# Altium schematic sheet Power-Supply-Card.SchDoc
size A2 portrait; Organization: Altium Limited; Address1: L3, 12a Rodborough Rd; Address2: Frenchs Forest; Address3: NSW; Address4: Australia 2086
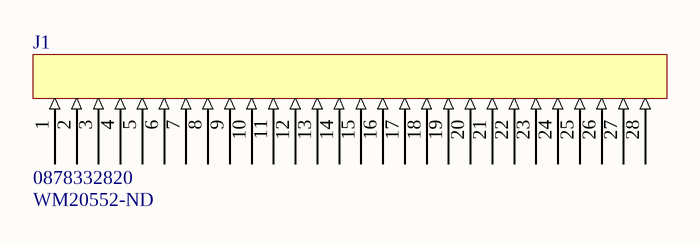
[diagram p0: Power-Supply-Card.SchDoc]

## Parts
J1  0878332820  Supplier Part Number 1: WM20552-ND  [0878332820]

## Nets

Not connected (* = marked no-connect by the designer): J1 1 2 3 4 5 6 7 8 9 10 11 12 13 14 15 16 17 18 19 20 21 22 23 24 25 26 27 28

## Notes on the sheet
- Title
- Size:
- Date:
- File:
- A2
- Number:
- Time:
- Revision:
- Sheet
- of

## Library data of the parts
J1 = 0878332820: Supplier 1: Digi-Key